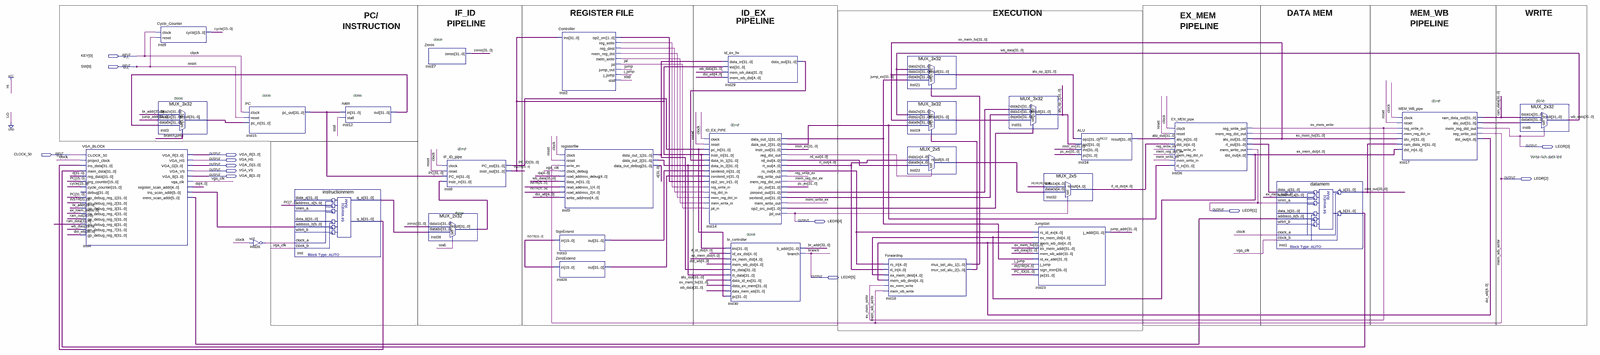
[diagram p0: schematic sheet, whole]
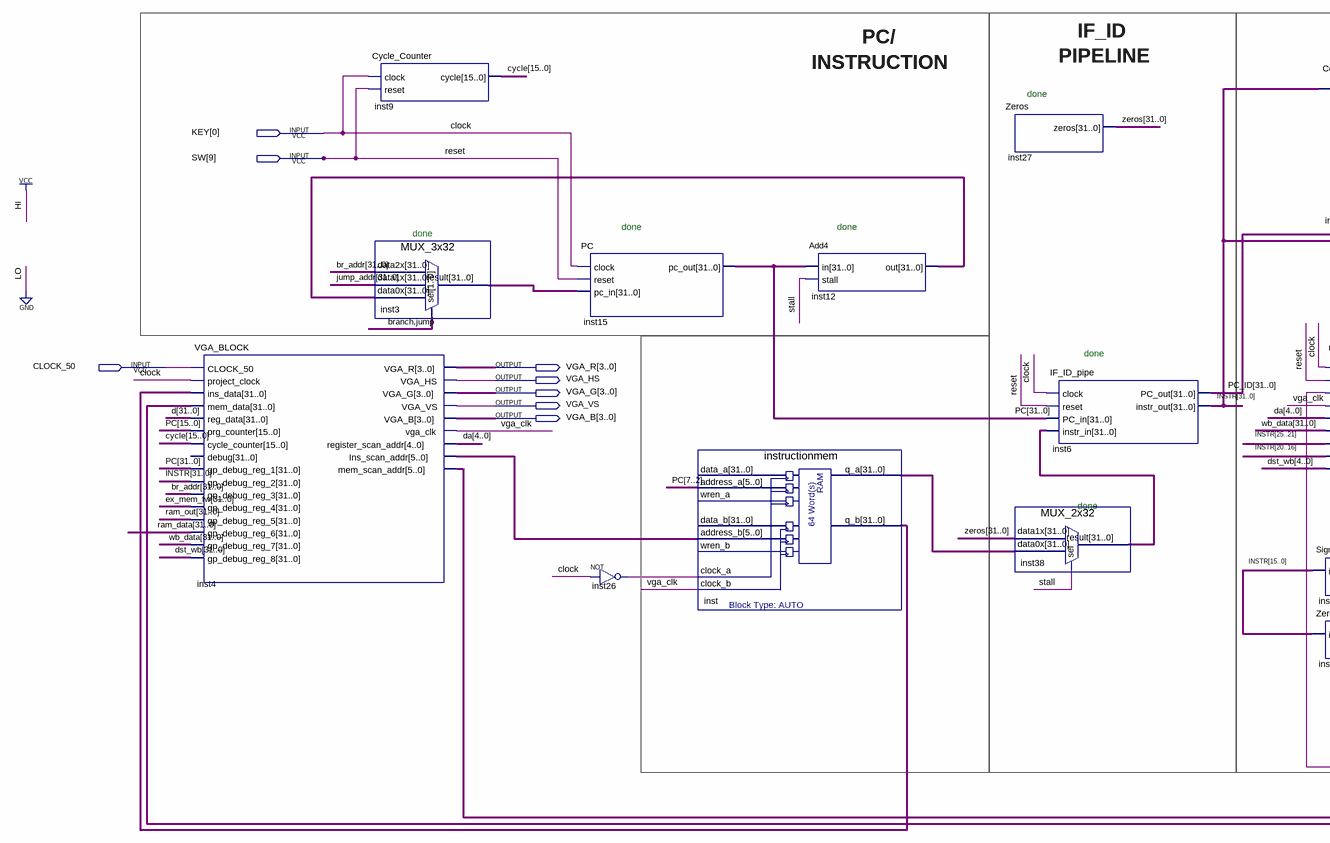
[diagram p1: schematic sheet, left part]
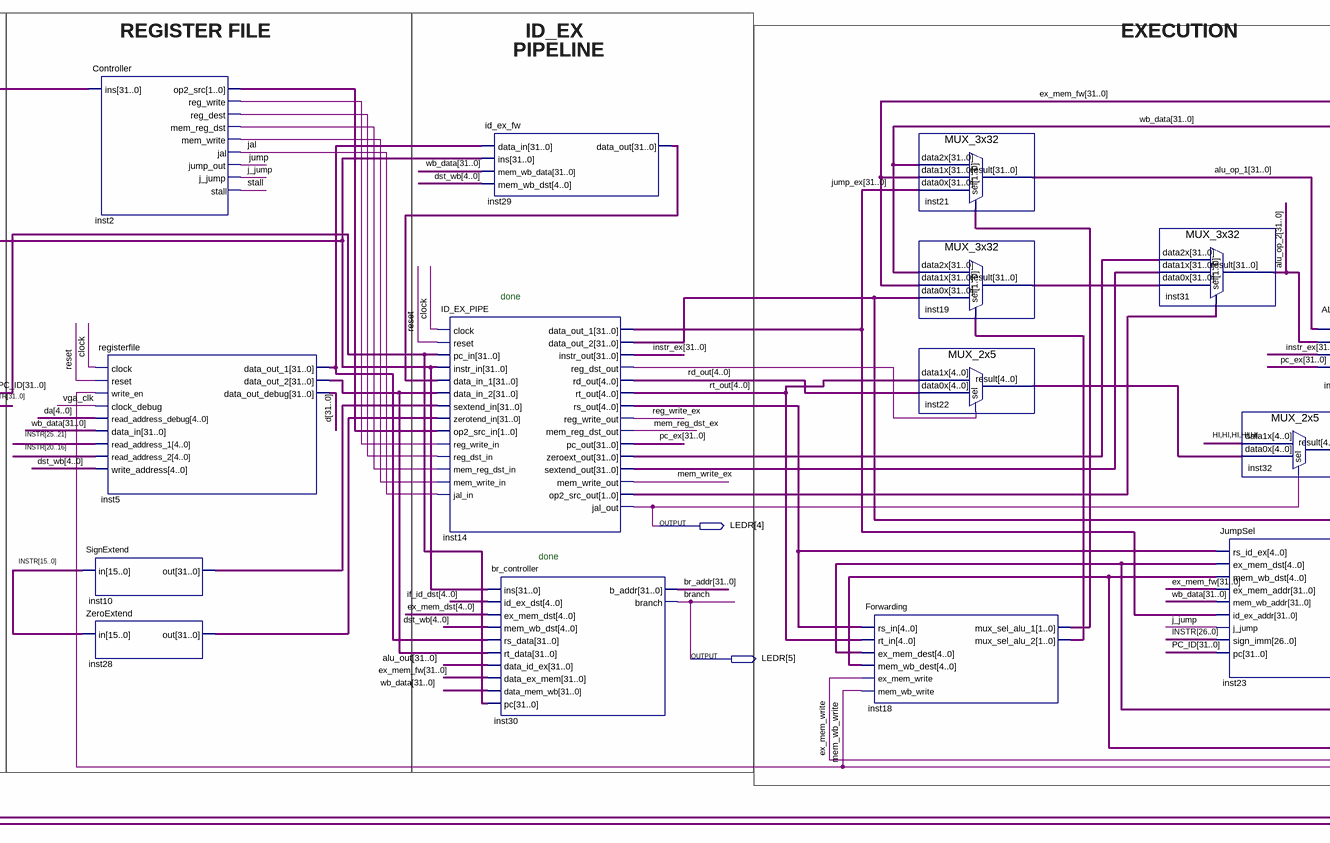
[diagram p2: schematic sheet, centre part]
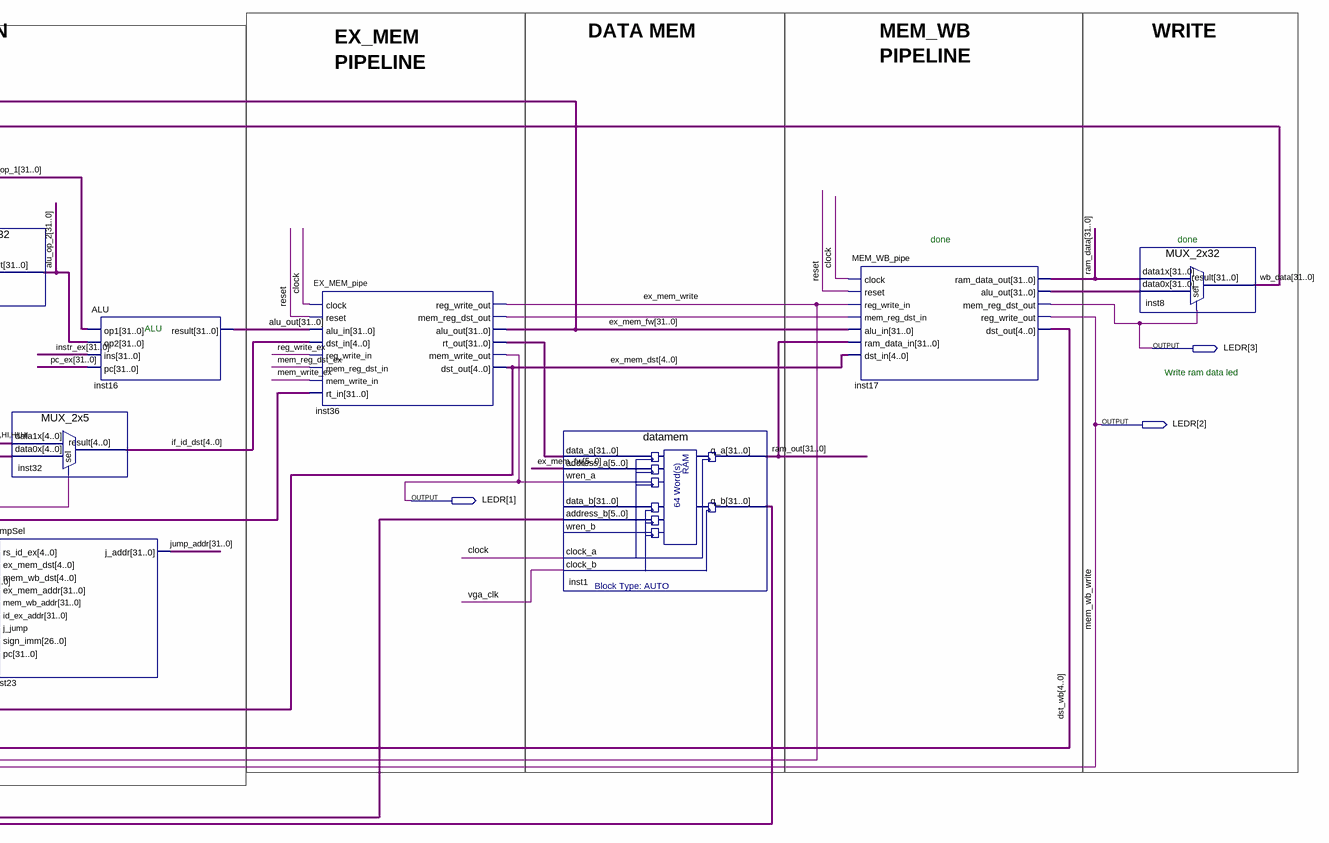
[diagram p3: schematic sheet, right part]
// Quartus schematic VGADEMO.bdf as structural Verilog: 29 symbols, 13 pins
module VGADEMO (
  input  [0:0] KEY,
  input  [9:9] SW,
  input  CLOCK_50,
  output [5:1] LEDR,
  output [3:0] VGA_R,
  output VGA_HS,
  output [3:0] VGA_G,
  output VGA_VS,
  output [3:0] VGA_B
);

  wire ex_mem_write, inst2_mem_reg_dst, inst2_mem_write, inst2_reg_dest, inst2_reg_write, inst14_reg_dst_out,
       inst26_out, inst36_mem_reg_dst_out, j_jump, jal, jump, mem_reg_dst_ex, mem_write_ex, reg_write_ex,
       stall, vga_clk;
  wire [1:0] inst2_op2_src, inst14_op2_src_out, inst18_mux_sel_alu_1, inst18_mux_sel_alu_2;
  wire [4:0] da, ex_mem_dst, if_id_dst, inst14_rs_out, inst22_result, rd_out, rt_out;
  wire [5:0] inst4_ins_scan_addr, inst4_mem_scan_addr;
  wire [15:0] cycle;
  wire [31:0] alu_op_1, alu_op_2, alu_out, br_addr, d, dst_wb, ex_mem_fw, inst1_q_b, inst3_result,
       inst5_data_out_1, inst5_data_out_2, inst10_out, inst12_out, inst14_data_out_2, inst14_sextend_out,
       inst14_zeroext_out, inst17_alu_out, inst19_result, inst28_out, inst29_data_out, inst36_rt_out,
       inst38_result, inst_q_a, inst_q_b, INSTR, instr_ex, jump_addr, jump_ex, PC, pc_ex, PC_ID, ram_data,
       ram_out, wb_data, zeros;

  VGA_BLOCK inst4 (
    .CLOCK_50(CLOCK_50), .project_clock(KEY[0]), .ins_data(inst_q_b), .mem_data(inst1_q_b), .reg_data(d),
    .prg_counter(PC[15:0]), .cycle_counter(cycle), .gp_debug_reg_1(PC), .gp_debug_reg_2(INSTR),
    .gp_debug_reg_3(br_addr), .gp_debug_reg_4(ex_mem_fw), .gp_debug_reg_5(ram_out),
    .gp_debug_reg_6(ram_data), .gp_debug_reg_7(wb_data), .gp_debug_reg_8(dst_wb), .VGA_R(VGA_R),
    .VGA_HS(VGA_HS), .VGA_G(VGA_G), .VGA_VS(VGA_VS), .VGA_B(VGA_B), .vga_clk(vga_clk),
    .register_scan_addr(da), .Ins_scan_addr(inst4_ins_scan_addr), .mem_scan_addr(inst4_mem_scan_addr));  // open: debug
  Cycle_Counter inst9 (.clock(KEY[0]), .reset(SW[9]), .cycle(cycle));
  MUX_3x32 inst3 (
    .data2x(br_addr), .data1x(jump_addr), .data0x(inst12_out), .sel({LEDR[5], jump}), .result(inst3_result));
  PC inst15 (.clock(KEY[0]), .reset(SW[9]), .pc_in(inst3_result), .pc_out(PC));
  not inst26 (inst26_out, KEY[0]);
  instructionmem inst (
    .address_a(PC[7:2]), .address_b(inst4_ins_scan_addr), .clock_a(inst26_out), .clock_b(vga_clk),
    .q_a(inst_q_a), .q_b(inst_q_b));  // open: data_a, wren_a, data_b, wren_b
  Add4 inst12 (.in(PC), .stall(stall), .out(inst12_out));
  Zeros inst27 (.zeros(zeros));
  MUX_2x32 inst38 (.data1x(zeros), .data0x(inst_q_a), .sel(stall), .result(inst38_result));
  IF_ID_pipe inst6 (
    .clock(KEY[0]), .reset(SW[9]), .PC_in(PC), .instr_in(inst38_result), .PC_out(PC_ID), .instr_out(INSTR));
  Controller inst2 (
    .ins(INSTR), .op2_src(inst2_op2_src), .reg_write(inst2_reg_write), .reg_dest(inst2_reg_dest),
    .mem_reg_dst(inst2_mem_reg_dst), .mem_write(inst2_mem_write), .jal(jal), .jump_out(jump),
    .j_jump(j_jump), .stall(stall));
  SignExtend inst10 (.in(INSTR[15:0]), .out(inst10_out));
  ZeroExtend inst28 (.in(INSTR[15:0]), .out(inst28_out));
  registerfile inst5 (
    .clock(KEY[0]), .reset(SW[9]), .write_en(LEDR[2]), .clock_debug(vga_clk), .read_address_debug(da),
    .data_in(wb_data), .read_address_1(INSTR[25:21]), .read_address_2(INSTR[20:16]),
    .write_address(dst_wb[4:0]), .data_out_1(inst5_data_out_1), .data_out_2(inst5_data_out_2),
    .data_out_debug(d));
  ID_EX_PIPE inst14 (
    .clock(KEY[0]), .reset(SW[9]), .pc_in(PC_ID), .instr_in(INSTR), .data_in_1(inst29_data_out),
    .data_in_2(inst5_data_out_2), .sextend_in(inst10_out), .zerotend_in(inst28_out),
    .op2_src_in(inst2_op2_src), .reg_write_in(inst2_reg_write), .reg_dst_in(inst2_reg_dest),
    .mem_reg_dst_in(inst2_mem_reg_dst), .mem_write_in(inst2_mem_write), .jal_in(jal), .data_out_1(jump_ex),
    .data_out_2(inst14_data_out_2), .instr_out(instr_ex), .reg_dst_out(inst14_reg_dst_out), .rd_out(rd_out),
    .rt_out(rt_out), .rs_out(inst14_rs_out), .reg_write_out(reg_write_ex), .mem_reg_dst_out(mem_reg_dst_ex),
    .pc_out(pc_ex), .zeroext_out(inst14_zeroext_out), .sextend_out(inst14_sextend_out),
    .mem_write_out(mem_write_ex), .op2_src_out(inst14_op2_src_out), .jal_out(LEDR[4]));
  id_ex_fw inst29 (
    .data_in(inst5_data_out_1), .ins(INSTR), .mem_wb_data(wb_data), .mem_wb_dst(dst_wb[4:0]),
    .data_out(inst29_data_out));
  br_controller inst30 (
    .ins(INSTR), .id_ex_dst(if_id_dst), .ex_mem_dst(ex_mem_dst), .mem_wb_dst(dst_wb[4:0]),
    .rs_data(inst5_data_out_1), .rt_data(inst5_data_out_2), .data_id_ex(alu_out), .data_ex_mem(ex_mem_fw),
    .data_mem_wb(wb_data), .pc(PC_ID), .b_addr(br_addr), .branch(LEDR[5]));
  Forwarding inst18 (
    .rs_in(inst14_rs_out), .rt_in(rt_out), .ex_mem_dest(ex_mem_dst), .mem_wb_dest(dst_wb[4:0]),
    .ex_mem_write(ex_mem_write), .mem_wb_write(LEDR[2]), .mux_sel_alu_1(inst18_mux_sel_alu_1),
    .mux_sel_alu_2(inst18_mux_sel_alu_2));
  MUX_3x32 inst21 (
    .data2x(wb_data), .data1x(ex_mem_fw), .data0x(jump_ex), .sel(inst18_mux_sel_alu_1), .result(alu_op_1));
  MUX_3x32 inst19 (
    .data2x(wb_data), .data1x(ex_mem_fw), .data0x(inst14_data_out_2), .sel(inst18_mux_sel_alu_2),
    .result(inst19_result));
  MUX_2x5 inst22 (.data1x(rt_out), .data0x(rd_out), .sel(inst14_reg_dst_out), .result(inst22_result));
  MUX_3x32 inst31 (
    .data2x(inst14_zeroext_out), .data1x(inst14_sextend_out), .data0x(inst19_result),
    .sel(inst14_op2_src_out), .result(alu_op_2));
  MUX_2x5 inst32 (.data1x({5{1'b1}}), .data0x(inst22_result), .sel(LEDR[4]), .result(if_id_dst));
  JumpSel inst23 (
    .rs_id_ex(inst14_rs_out), .ex_mem_dst(ex_mem_dst), .mem_wb_dst(dst_wb[4:0]), .ex_mem_addr(ex_mem_fw),
    .mem_wb_addr(wb_data), .id_ex_addr(jump_ex), .j_jump(j_jump), .sign_imm(INSTR[26:0]), .pc(PC_ID),
    .j_addr(jump_addr));
  ALU inst16 (.op1(alu_op_1), .op2(alu_op_2), .ins(instr_ex), .pc(pc_ex), .result(alu_out));
  EX_MEM_pipe inst36 (
    .clock(KEY[0]), .reset(SW[9]), .alu_in(alu_out), .dst_in(if_id_dst), .reg_write_in(reg_write_ex),
    .mem_reg_dst_in(mem_reg_dst_ex), .mem_write_in(mem_write_ex), .rt_in(inst14_data_out_2),
    .reg_write_out(ex_mem_write), .mem_reg_dst_out(inst36_mem_reg_dst_out), .alu_out(ex_mem_fw),
    .rt_out(inst36_rt_out), .mem_write_out(LEDR[1]), .dst_out(ex_mem_dst));
  datamem inst1 (
    .data_a(inst36_rt_out), .address_a(ex_mem_fw[5:0]), .wren_a(LEDR[1]), .address_b(inst4_mem_scan_addr),
    .clock_a(KEY[0]), .clock_b(vga_clk), .q_a(ram_out), .q_b(inst1_q_b));  // open: data_b, wren_b
  MEM_WB_pipe inst17 (
    .clock(KEY[0]), .reset(SW[9]), .reg_write_in(ex_mem_write), .mem_reg_dst_in(inst36_mem_reg_dst_out),
    .alu_in(ex_mem_fw), .ram_data_in(ram_out), .dst_in(ex_mem_dst), .ram_data_out(ram_data),
    .alu_out(inst17_alu_out), .mem_reg_dst_out(LEDR[3]), .reg_write_out(LEDR[2]), .dst_out(dst_wb[4:0]));
  MUX_2x32 inst8 (.data1x(ram_data), .data0x(inst17_alu_out), .sel(LEDR[3]), .result(wb_data));

  // Other names for the same wires on the sheet: clock = KEY[0]; mem_wb_write = LEDR[2]; branch = LEDR[5];
  //   reset = SW[9]

  // Notes on the sheet:
  //   IF_ID
  //   REGISTER FILE
  //   ID_EX
  //   EXECUTION
  //   DATA MEM
  //   MEM_WB
  //   WRITE
  //   PC/
  //   EX_MEM
  //   PIPELINE
  //   PIPELINE
  //   PIPELINE
  //   INSTRUCTION
  //   PIPELINE
  //   done
  //   done
  //   done
  //   done
  //   done
  //   done
  //   done
  //   ALU
  //   done
  //   Write ram data led
  //   done
  //   done
endmodule
